# EAGLE schematic Seeed Studio XIAO nRF52840 v1.1 (EAGLE 9.6.2)
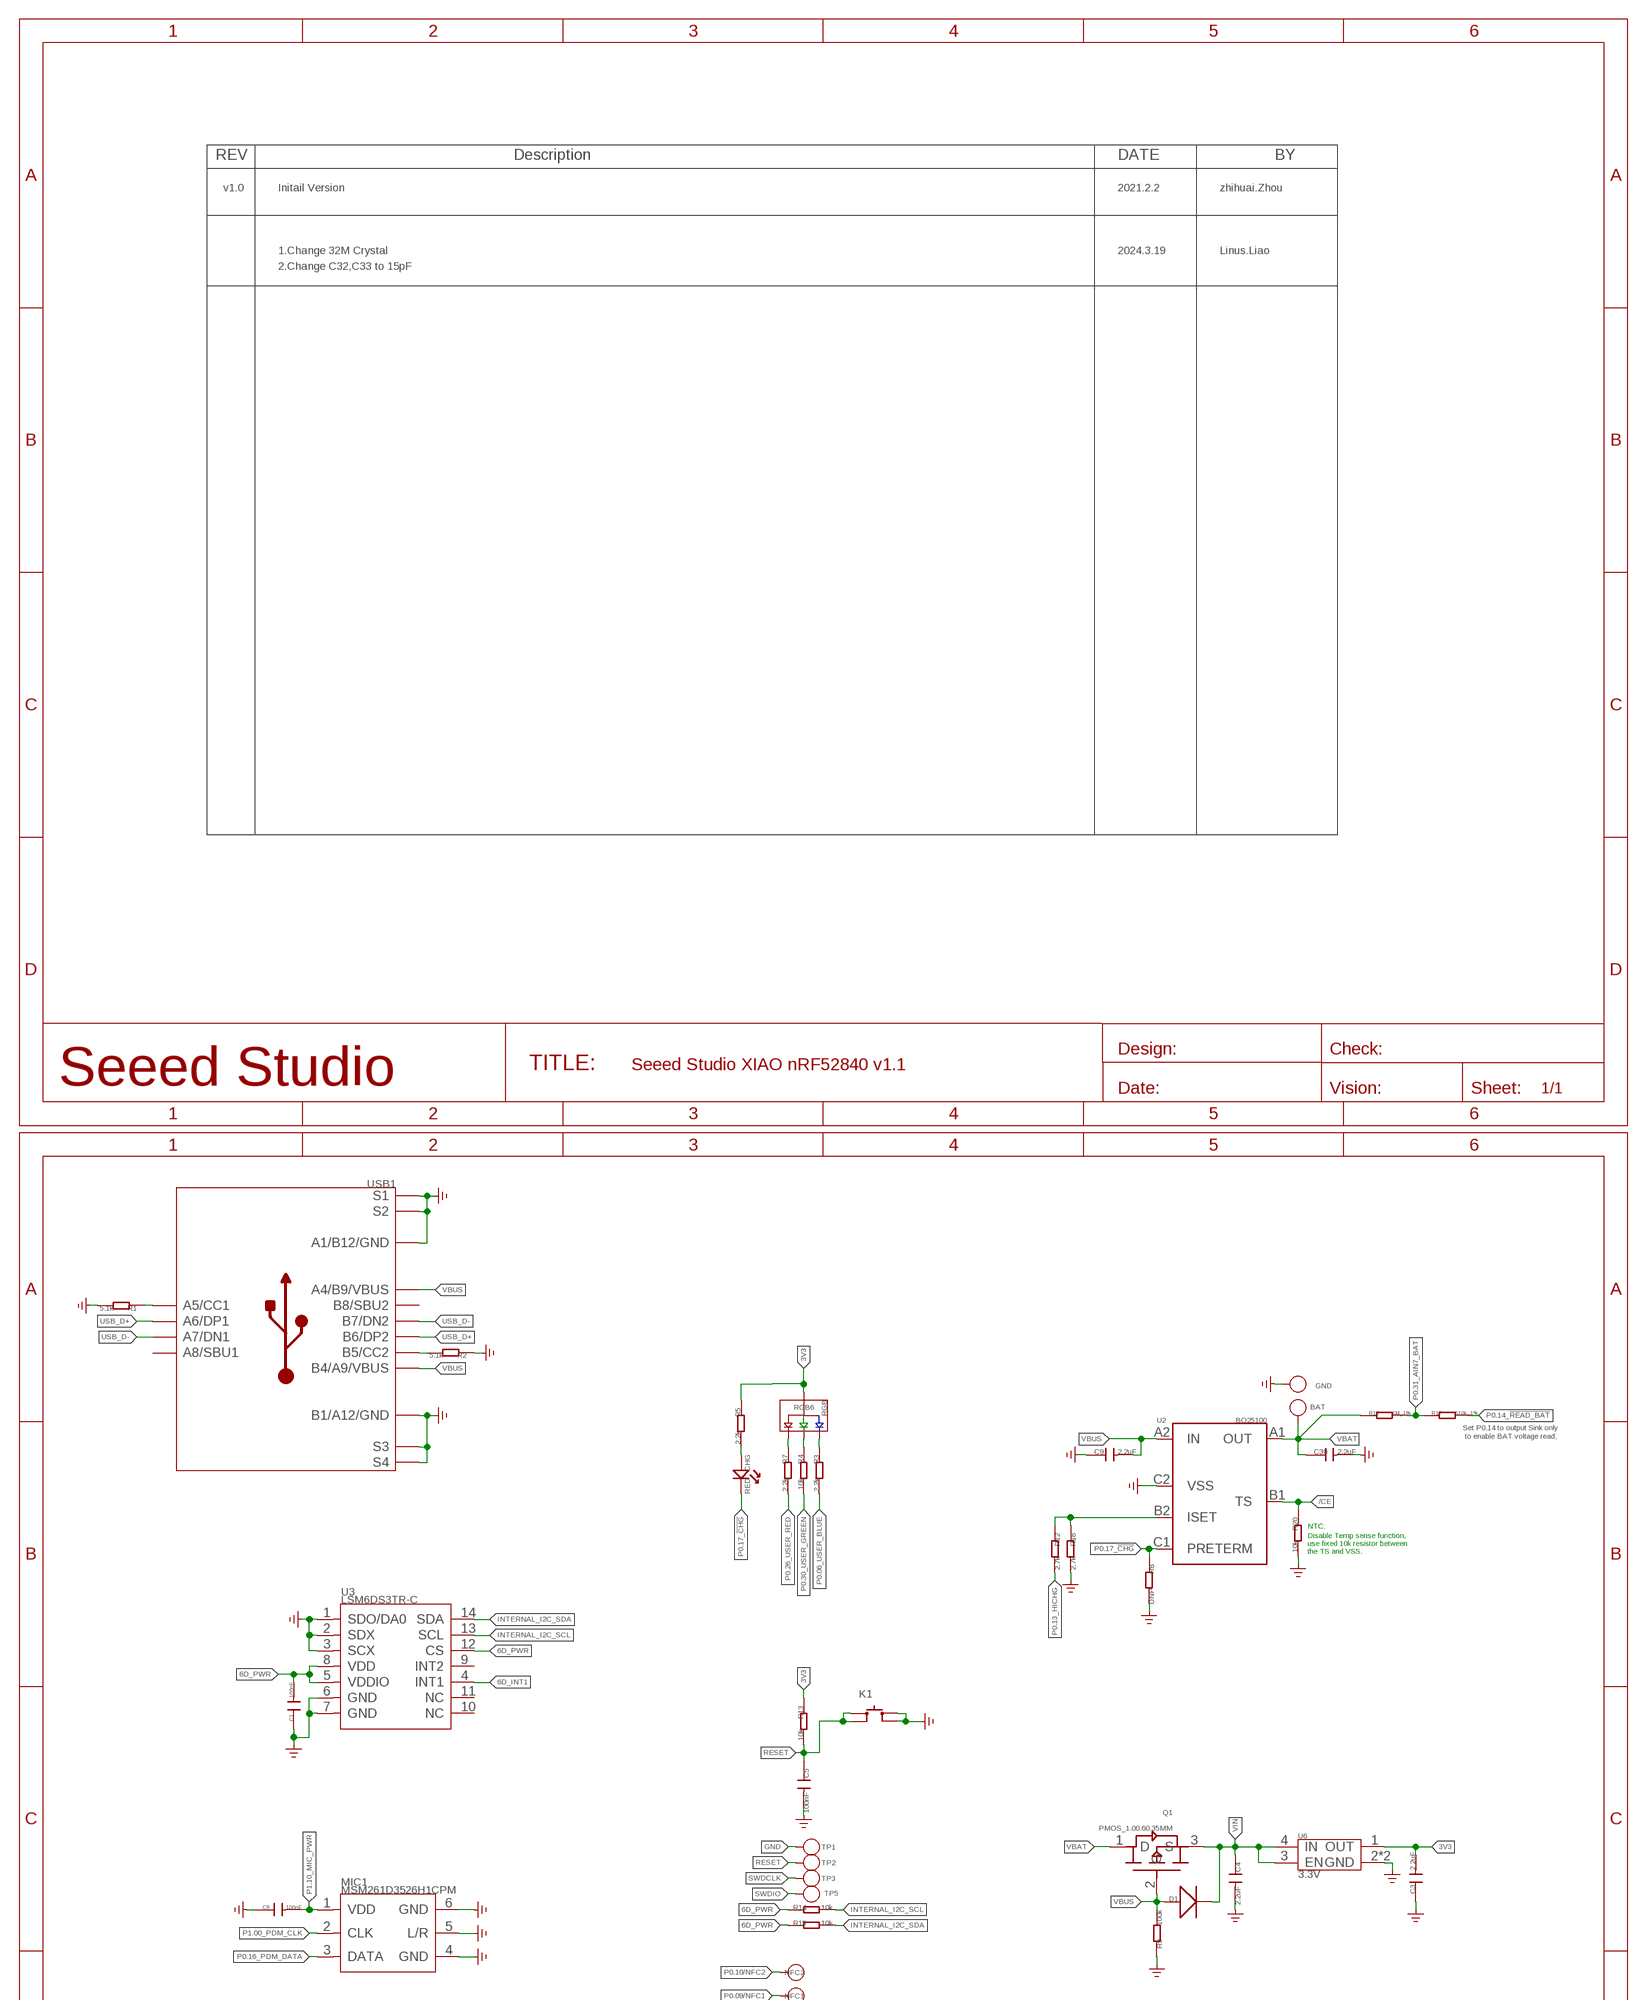
[diagram p0: schematic, sheet 1, part 1 of 2]
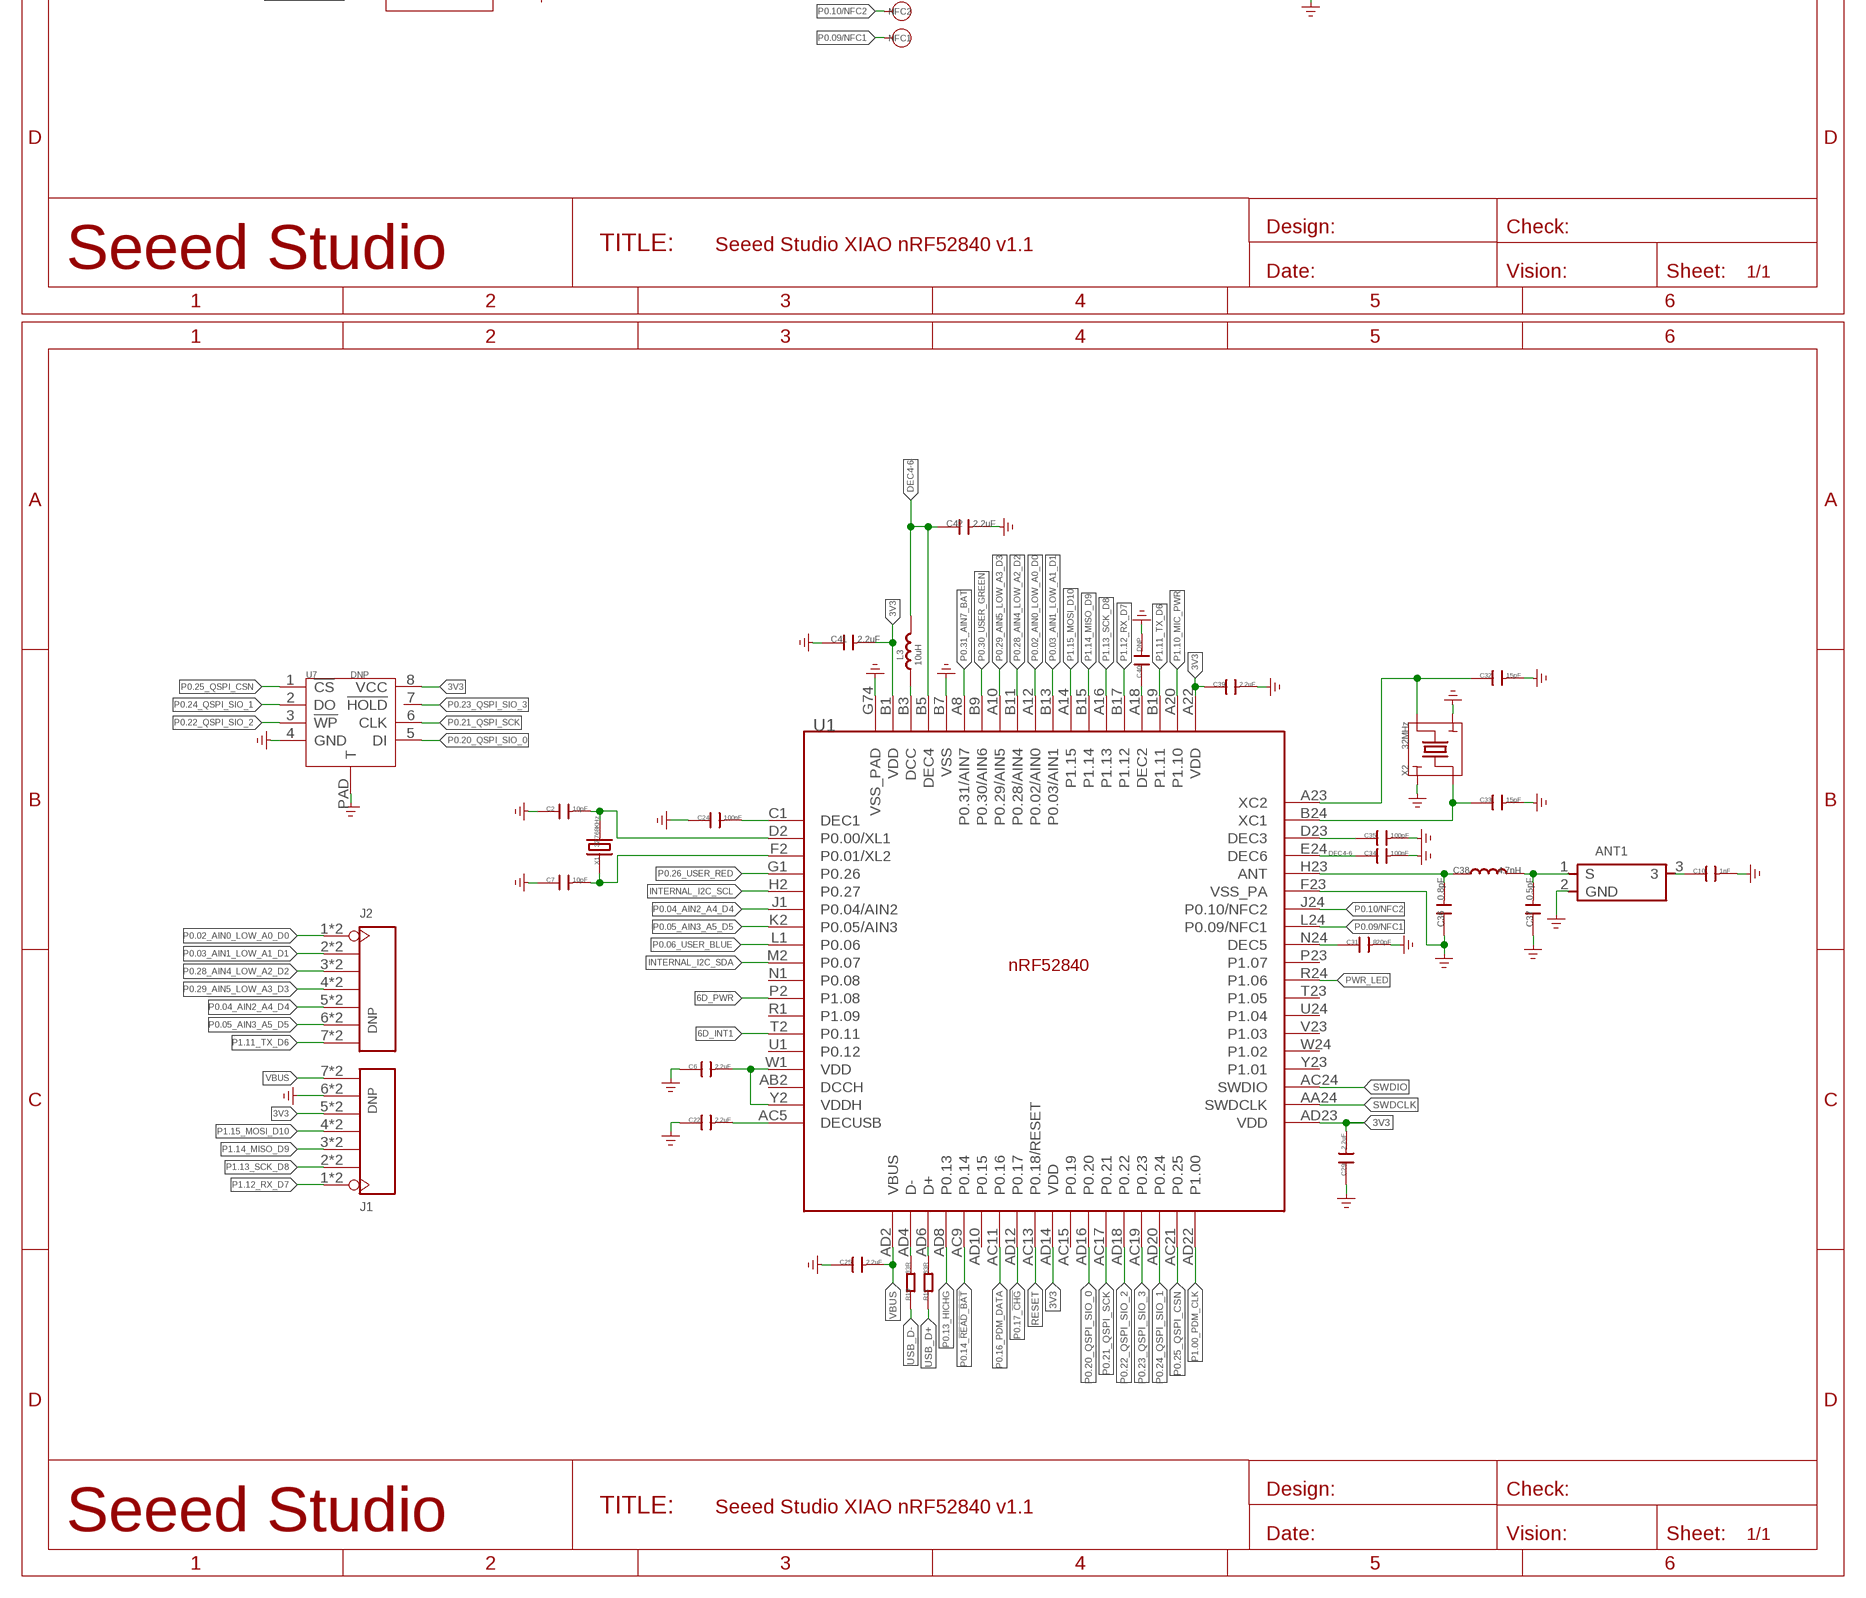
[diagram p1: schematic, sheet 1, part 2 of 2]

## Parts
ANT1  ANTENNA-AN3216  [ANT-SMD3P-3.2X1.6X1.04MM]
BAT  TEST-POINT'4080'  [TP-80X40MIL]
C1  100nF  C-0201  [C0201]
C2  10pF  C-0201  [C0201]
C3  2.2uF  C-0201  [C0201]
C4  2.2uF  C-0201  [C0201]
C5  100nF  C-0201  [C0201]
C6  2.2uF  C-0201  [C0201]
C7  10pF  C-0201  [C0201]
C8  100nF  C-0201  [C0201]
C9  2.2uF  C-0201  [C0201]
C10  1nF  C-0402  [C0402]
C22  2.2uF  C-0201  [C0201]
C24  100nF  C-0201  [C0201]
C25  2.2uF  C-0201  [C0201]
C29  2.2uF  C-0201  [C0201]
C30  2.2uF  C-0201  [C0201]
C31  820pF  C-0201  [C0201]
C32  15pF  C-0201  [C0201]
C33  15pF  C-0201  [C0201]
C34  100nF  C-0201  [C0201]
C35  100pF  C-0201  [C0201]
C36  0.8pF  C-0201  [C0201]
C37  0.5pF  C-0201  [C0201]
C38  4.7nH  L0201  [L0201]
C39  2.2uF  C-0201  [C0201]
C40  DNP  C-0201  [C0201]
C41  2.2uF  C-0201  [C0201]
C42  2.2uF  C-0201  [C0201]
CHG  RED  LED-0402  [LED-0402]
D1  DIODE'0603'  [SOD-523]
GND  GND  TEST-POINT'4080'  [TP-80X40MIL]
J1  DNP  HEADER-7P-HALF-HOLE-2.54  [H7-HALF-HOLE-2.54]
J2  DNP  HEADER-7P-HALF-HOLE-2.54  [H7-HALF-HOLE-2.54]
K1  BUTTON-4P  [SW4-SMD-2.8-2.6X1.6X0.53MM]
L3  10uH  L0603  [L0603]
MIC1  MSM261D3526H1CPM  MIC-MSM261D3526H1CPM  [MIC6P-3.5X2.65X0.94MM]
NFC1  TEST-POINT'4080'  [TP-80X40MIL]
NFC2  TEST-POINT'4080'  [TP-80X40MIL]
Q1  PMOS_1.00.60.35MM  [PMOS_1.0*0.6*0.35MM]
R1  5.1k  R-0201  [R0201]
R2  5.1k  R-0201  [R0201]
R3  2.2k  R-0201  [R0201]
R4  10k  R-0201  [R0201]
R5  2.2k  R-0201  [R0201]
R7  2.2k  R-0201  [R0201]
R8  DNP  R-0201  [R0201]
R9  100k  R-0201  [R0201]
R10  33R  R-0201  [R0201]
R11  33R  R-0201  [R0201]
R12  2.7k  R-0201  [R0201]
R13  10k  R-0201  [R0201]
R14  10k  R-0201  [R0201]
R15  10k  R-0201  [R0201]
R16  1M_1%  R-0201  [R0201]
R17  510k_1%  R-0201  [R0201]
R18  2.7k  R-0201  [R0201]
R20  10k  R-0201  [R0201]
RGB6  RGB  RGB-1010  [4P1010]
TP1  TEST-POINT'4545'  [TP-D45MIL]
TP2  TEST-POINT'4545'  [TP-D45MIL]
TP3  TEST-POINT'4545'  [TP-D45MIL]
TP5  TEST-POINT'4545'  [TP-D45MIL]
U1  NRF52840_QF  [AQFN50P700X700X85_HS-74N]
U2  BQ25100  BQ25101_DSBGA_6_BQ25101_DSBGA_6  [BQ25101_DSBGA_6_BQ25101]
U3  LSM6DS3TR-C  SENSOR-LSM6DS3TR-C  [LGA14-0.5-2.5X3X0.86MM]
U6  3.3V  TLV733P  [X2SON-4]
U7  DNP  W25XXC  [USON2X3_8]
USB1  USB2.0-TYPE-C  [USB2.0-TYPE-C]
X1  32.768KHz  CRYSTAL-2P-1610  [X2-SMD-L1.6X1.0X0.5MM]
X2  32MHz  CRYSTAL'-1612'  [4P1612]

## Nets
3V3: C3.2 C6.2 C29.2 C39.1 C41.2 J1.5 J1.17 R5.1 R13.1 RGB6.+ U1.A22(VDD) U1.AD14(VDD) U1.AD23(VDD) U1.B1(VDD) U1.W1(VDD) U1.Y2(VDDH) U6.1(OUT) U7.8(VCC)
6D_INT1: U1.T2(P0.11) U3.4(INT1)
6D_PWR: C1.2 R14.1 R15.1 U1.P2(P1.08) U3.5(VDDIO) U3.8(VDD) U3.12(CS)
/CE: R20.1 U2.B1(TS)
DEC4-6: C34.1 C42.1 L3.2 U1.B5(DEC4) U1.E24(DEC6)
GND: ANT1.2(GND) C1.1 C2.1 C3.1 C4.2 C5.2 C6.1 C7.1 C8.1 C9.1 C10.2 C22.1 C24.1 C25.1 C29.1 C30.2 C31.2 C32.2 C33.2 C34.2 C35.2 C36.1 C37.1 C39.2 C40.2 C41.1 C42.2 GND.1(T) J1.6 J1.18 K1.2(B0) K1.4(B1) MIC1.4(GND) MIC1.5(L/R) MIC1.6(GND) R1.2 R2.1 R8.2 R9.1 R18.2 R20.2 TP1.T U1.B7(VSS) U1.F23(VSS_PA) U1.G74(VSS_PAD) U2.C2(VSS) U3.1(SDO/DA0) U3.2(SDX) U3.3(SCX) U3.6(GND) U3.7(GND) U6.2(GND) U6.T(GND) U7.4(GND) U7.PAD(T) USB1.A1_B12(A1/B12/GND) USB1.B1_A12(B1/A12/GND) USB1.S1 USB1.S2 USB1.S3 USB1.S4 USB1.S5(S1) USB1.S6(S2) X2.2 X2.4 ; supply symbol labelled GND_POWER
INTERNAL_I2C_SCL: R14.2 U1.H2(P0.27) U3.13(SCL)
INTERNAL_I2C_SDA: R15.2 U1.M2(P0.07) U3.14(SDA)
N$1: R1.1 USB1.A5(A5/CC1)
N$2: R2.2 USB1.B5(B5/CC2)
N$3: C2.2 U1.D2(P0.00/XL1) X1.2
N$4: C7.2 U1.F2(P0.01/XL2) X1.1
N$5: R7.1 RGB6.R-
N$6: R4.1 RGB6.G-
N$7: R10.2 U1.AD4(D-)
N$8: R11.2 U1.AD6(D+)
N$9: R3.1 RGB6.B-
N$10: CHG.+ R5.2
N$12: ANT1.3 C10.1
N$20: R12.1 R18.1 U2.B2(ISET)
N$23: C22.2 U1.AC5(DECUSB)
N$24: C24.2 U1.C1(DEC1)
N$25: C31.1 U1.N24(DEC5)
N$26: C33.1 U1.B24(XC1) X2.1
N$27: C32.1 U1.A23(XC2) X2.3
N$28: C35.1 U1.D23(DEC3)
N$30: C36.2 C38.1 U1.H23(ANT)
N$31: ANT1.1(S) C37.2 C38.2
N$32: C40.1 U1.A18(DEC2)
N$35: L3.1 U1.B3(DCC)
P0.02_AIN0_LOW_A0_D0: J2.1 J2.13 U1.A12(P0.02/AIN0)
P0.03_AIN1_LOW_A1_D1: J2.2 J2.14 U1.B13(P0.03/AIN1)
P0.04_AIN2_A4_D4: J2.5 J2.17 U1.J1(P0.04/AIN2)
P0.05_AIN3_A5_D5: J2.6 J2.18 U1.K2(P0.05/AIN3)
P0.06_USER_BLUE: R3.2 U1.L1(P0.06)
P0.09/NFC1: NFC1.1(T) U1.L24(P0.09/NFC1)
P0.10/NFC2: NFC2.1(T) U1.J24(P0.10/NFC2)
P0.13_HICHG: R12.2 U1.AD8(P0.13)
P0.14_!READ_BAT: R17.2 U1.AC9(P0.14)
P0.16_PDM_DATA: MIC1.3(DATA) U1.AC11(P0.16)
P0.17_!CHG: CHG.- R8.1 U1.AD12(P0.17) U2.C1(PRETERM)
P0.20_QSPI_SIO_0: U1.AD16(P0.20) U7.5(DI)
P0.21_QSPI_SCK: U1.AC17(P0.21) U7.6(CLK)
P0.22_QSPI_SIO_2: U1.AD18(P0.22) U7.3(!WP)
P0.23_QSPI_SIO_3: U1.AC19(P0.23) U7.7(!HOLD)
P0.24_QSPI_SIO_1: U1.AD20(P0.24) U7.2(DO)
P0.25_QSPI_CSN: U1.AC21(P0.25) U7.1(!CS)
P0.26_USER_RED: R7.2 U1.G1(P0.26)
P0.28_AIN4_LOW_A2_D2: J2.3 J2.15 U1.B11(P0.28/AIN4)
P0.29_AIN5_LOW_A3_D3: J2.4 J2.16 U1.A10(P0.29/AIN5)
P0.30_USER_GREEN: R4.2 U1.B9(P0.30/AIN6)
P0.31_AIN7_BAT: R16.2 R17.1 U1.A8(P0.31/AIN7)
P1.00_PDM_CLK: MIC1.2(CLK) U1.AD22(P1.00)
P1.10_MIC_PWR: C8.2 MIC1.1(VDD) U1.A20(P1.10)
P1.11_TX_D6: J2.7 J2.19 U1.B19(P1.11)
P1.12_RX_D7: J1.1 J1.13 U1.B17(P1.12)
P1.13_SCK_D8: J1.2 J1.14 U1.A16(P1.13)
P1.14_MISO_D9: J1.3 J1.15 U1.B15(P1.14)
P1.15_MOSI_D10: J1.4 J1.16 U1.A14(P1.15)
PWR_LED: U1.R24(P1.06)
RESET: C5.1 K1.1(A0) K1.3(A1) R13.2 TP2.T U1.AC13(P0.18/RESET)
SWDCLK: TP3.T U1.AA24(SWDCLK)
SWDIO: TP5.T U1.AC24(SWDIO)
USB_D+: R11.1 USB1.A6(A6/DP1) USB1.B6(B6/DP2)
USB_D-: R10.1 USB1.A7(A7/DN1) USB1.B7(B7/DN2)
VBAT: BAT.1(T) C30.1 Q1.1(D) R16.1 U2.A1(OUT)
VBUS: C9.2 C25.2 D1.+ J1.7 J1.19 Q1.2(G) R9.2 U1.AD2(VBUS) U2.A2(IN) USB1.A4_B9(A4/B9/VBUS) USB1.B4_A9(B4/A9/VBUS)
VIN: C4.1 D1.- Q1.3(S) U6.3(EN) U6.4(IN)
Unconnected: U1.AB2(DCCH) U1.AC15(P0.19) U1.AD10(P0.15) U1.N1(P0.08) U1.P23(P1.07) U1.R1(P1.09) U1.T23(P1.05) U1.U1(P0.12) U1.U24(P1.04) U1.V23(P1.03) U1.W24(P1.02) U1.Y23(P1.01) U3.9(INT2) U3.10(NC) U3.11(NC) USB1.A8(A8/SBU1) USB1.B8(B8/SBU2)

## Notes on the sheet
- v1.0 | Initail Version | 2021.2.2 | zhihuai.Zhou
- 1.Change 32M Crystal | 2024.3.19 | Linus.Liao
- 2.Change C32,C33 to 15pF
- Set P0.14 to output Sink only
   to enable BAT voltage read;
- NTC:
- Disable Temp sense function,
- use fixed 10k resistor between
- the TS and VSS.

## Library data of the parts
ANT1 = Antenna_rfeca3216060a1t:ANTENNA-AN3216
BAT GND NFC1 NFC2 = Discrete-new:TEST-POINT
C1-C10 C22 C24 C25 C29-C37 C39-C42 = GroveX:C*: Ceramic Capacitors
C38 L3 = GroveX:L*
CHG = Discrete-small:LED
D1 = Discrete-new:DIODE*
J1 J2 = Connector-new:HEADER-7P-HALF-HOLE
K1 = Making:BUTTON-4P
MIC1 = Making:MIC-MSM261D3526H1CPM
Q1 = PMOS_1006:PMOS_1.0*0.6*0.35MM: MCC:SI3139KL3 TI:CSD25481F4
R1-R5 R7-R18 R20 = GroveX:R*
RGB6 = LoRaPhone:RGB
TP1-TP3 TP5 = Discrete-new:TEST-POINT; PARTNO: DNP
U1 = Making:NRF52840_QF: nRF52840 Features Advanced Single chip 2.4 GHz multi-protocol SoC 32-bit ARM Cortex-M4F Processor 1.7v to 5.5v operation 1MB flash + 256kB RAM Bluetooth 5 support for long range and high throughput 802.15.4 radio support On-chip NFC PPI –Programmable Peripheral Interconnect Automated power management system with automatic power management of each peripheral Configurable I/O mapping for analog and digital I/O 48 x GPIO 1 x QSPI 4 x Master/Slave SPI 2 x Two-wire interface (I²C) I²S interface 2 x UART 4 x PWM USB 2.0 controller ARM TrustZone CryptoCell-310 Cryptographic and security module AES 128-bit ECB/CCM/AAR hardware accelerator Digital microphone interface (PDM) Quadrature decoder 12-bit ADC Low power comparator On-chip 50Ω balun On-air compatible with nRF52, nRF51 and nRF24 Series Applications Advanced high performance wearables Wearables for secure payments Virtual Reality/Augmented Reality systems Smart Home sensor networks Smart city sensor networks High performance HID controllers Internet of Things (IoT) sensor networks Smart door locks Smart lighting networks Connected white goods
U2 = Seeed XIAO BLE:BQ25101_DSBGA_6_BQ25101_DSBGA_6
U3 = Making:SENSOR-LSM6DS3TR-C
U6 = GroveX:TLV733P
U7 = USB2.0-TYPE-C:W25XXC
USB1 = USB C:USB2.0-TYPE-C
X1 = Discrete-new:CRYSTAL-2P
X2 = G2:CRYSTAL

## Net classes
0 default: width 0.089 mm, drill 0.2 mm, clearance 0.102 mm